# Altium schematic sheet ATMEGA328P ETH TCP.SchDoc
size A4; SheetNumber: 1; SheetTotal: 5
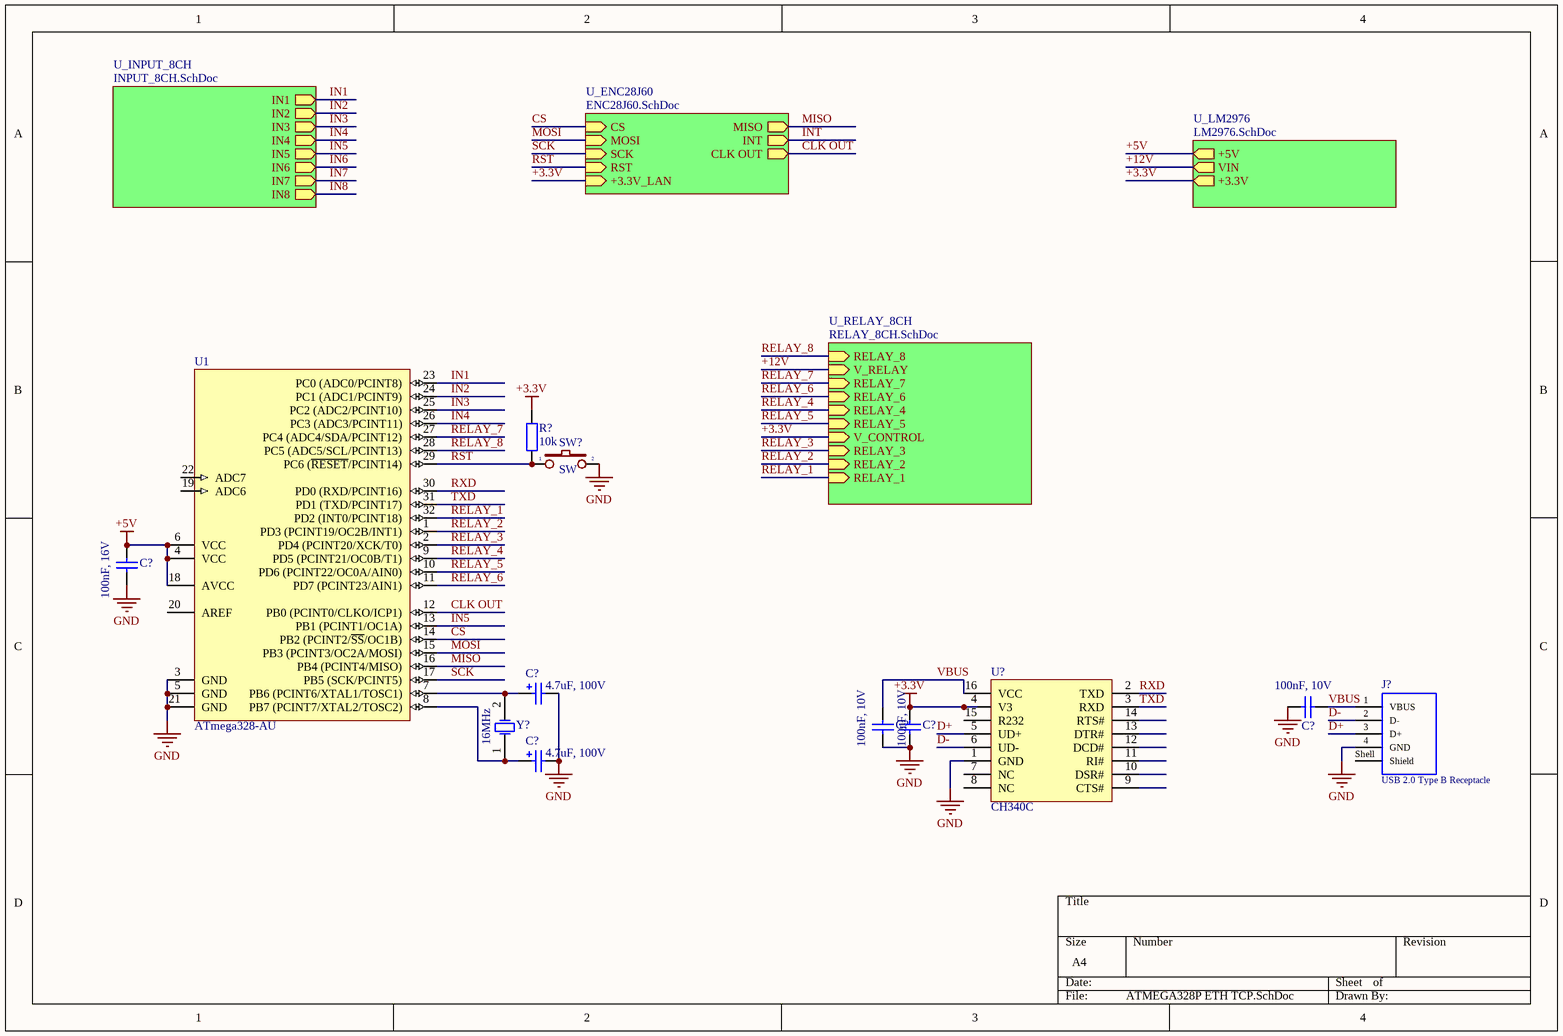
[diagram p0: ATMEGA328P ETH TCP.SchDoc]

## Parts
(Parts that share a designator on the sheet are numbered #1, #2 ... from top to bottom, then left to right.)
C?#1  100nF, 16V  [WCAP-CSGP_0402_L1W0.5H0.5]
C?#2  4.7uF, 100V  [WCAP-PSLP_D6.3H7.7]
C?#3  100nF, 10V  [WCAP-CSGP_0603_L1.6W0.8H0.8_Reflow]
C?#4  100nF, 10V  [WCAP-CSGP_0603_L1.6W0.8H0.8_Reflow]
C?#5  100nF, 10V  [WCAP-CSGP_0603_L1.6W0.8H0.8_Reflow]
C?#6  4.7uF, 100V  [WCAP-PSLP_D6.3H7.7]
J?  USB 2.0 Type B Receptacle  [61400416121]
R?  10k  [tro smd 0603]
SW?  SW  [SW1-SMD]
U1  ATmega328-AU  [TQFP32]
U?  CH340C  [SOIC16_50_284_25X90_SMT]
Y?  16MHz  [WE-XTAL_HC49/4HSMX]

## Sub-sheets
U_ENC28J60 = ENC28J60.SchDoc: CS (in), MOSI (in), MISO (out), SCK (in), INT (out), CLK OUT (out), RST (in), +3.3V_LAN (in)
U_INPUT_8CH = INPUT_8CH.SchDoc: IN1 (out), IN2 (out), IN3 (out), IN4 (out), IN5 (out), IN6 (out), IN7 (out), IN8 (out)
U_LM2976 = LM2976.SchDoc: +5V (out), VIN (out), +3.3V (out)
U_RELAY_8CH = RELAY_8CH.SchDoc: RELAY_1 (in), RELAY_2 (in), RELAY_3 (in), V_CONTROL (in), RELAY_5 (in), RELAY_4 (in), RELAY_6 (in), RELAY_7 (in), V_RELAY (in), RELAY_8 (in)

## Nets
+3.3V: C?#5.2 R?.2 U?.4(V3) ; sheet U_ENC28J60/+3.3V_LAN, sheet U_LM2976/+3.3V, sheet U_RELAY_8CH/V_CONTROL
+5V: C?#1.2 U1.4(VCC) U1.6(VCC) U1.18(AVCC) ; sheet U_LM2976/+5V
GND: C?#1.1 C?#2.2(N) C?#3.1 C?#4.1 C?#5.1 C?#6.2(N) J?.4(GND) SW?.2 U1.3(GND) U1.5(GND) U1.21(GND) U?.1(GND)
+12V: sheet U_LM2976/VIN, sheet U_RELAY_8CH/V_RELAY
CLK OUT: U1.12(PB0_(PCINT0/CLKO/ICP1)) ; sheet U_ENC28J60/CLK OUT
CS: U1.14(PB2_(PCINT2/~{SS}/OC1B)) ; sheet U_ENC28J60/CS
D+: J?.3(D+) U?.5(UD+)
D-: J?.2(D-) U?.6(UD-)
IN1: U1.23(PC0_(ADC0/PCINT8)) ; sheet U_INPUT_8CH/IN1
IN2: U1.24(PC1_(ADC1/PCINT9)) ; sheet U_INPUT_8CH/IN2
IN3: U1.25(PC2_(ADC2/PCINT10)) ; sheet U_INPUT_8CH/IN3
IN4: U1.26(PC3_(ADC3/PCINT11)) ; sheet U_INPUT_8CH/IN4
IN5: U1.13(PB1_(PCINT1/OC1A)) ; sheet U_INPUT_8CH/IN5
IN6: sheet U_INPUT_8CH/IN6
IN7: sheet U_INPUT_8CH/IN7
IN8: sheet U_INPUT_8CH/IN8
INT: sheet U_ENC28J60/INT
MISO: U1.16(PB4_(PCINT4/MISO)) ; sheet U_ENC28J60/MISO
MOSI: U1.15(PB3_(PCINT3/OC2A/MOSI)) ; sheet U_ENC28J60/MOSI
RELAY_1: U1.32(PD2_(INT0/PCINT18)) ; sheet U_RELAY_8CH/RELAY_1
RELAY_2: U1.1(PD3_(PCINT19/OC2B/INT1)) ; sheet U_RELAY_8CH/RELAY_2
RELAY_3: U1.2(PD4_(PCINT20/XCK/T0)) ; sheet U_RELAY_8CH/RELAY_3
RELAY_4: U1.9(PD5_(PCINT21/OC0B/T1)) ; sheet U_RELAY_8CH/RELAY_4
RELAY_5: U1.10(PD6_(PCINT22/OC0A/AIN0)) ; sheet U_RELAY_8CH/RELAY_5
RELAY_6: U1.11(PD7_(PCINT23/AIN1)) ; sheet U_RELAY_8CH/RELAY_6
RELAY_7: U1.27(PC4_(ADC4/SDA/PCINT12)) ; sheet U_RELAY_8CH/RELAY_7
RELAY_8: U1.28(PC5_(ADC5/SCL/PCINT13)) ; sheet U_RELAY_8CH/RELAY_8
RST: R?.1 SW?.1 U1.29(PC6_(~{RESET}/PCINT14)) ; sheet U_ENC28J60/RST
RXD: U1.30(PD0_(RXD/PCINT16)) U?.2(TXD)
SCK: U1.17(PB5_(SCK/PCINT5)) ; sheet U_ENC28J60/SCK
TXD: U1.31(PD1_(TXD/PCINT17)) U?.3(RXD)
VBUS: C?#3.2 C?#4.2 J?.1(VBUS) U?.16(VCC)
NetC?#2_1: C?#2.1(P) U1.7(PB6_(PCINT6/XTAL1/TOSC1)) Y?.2(OSC2)
NetC?#6_1: C?#6.1(P) U1.8(PB7_(PCINT7/XTAL2/TOSC2)) Y?.1(OSC1)

Not connected (* = marked no-connect by the designer): J? Shell(Shield); U1 19(ADC6) 20(AREF) 22(ADC7); U? 7(NC) 8(NC) 9(CTS#) 10(DSR#) 11(RI#) 12(DCD#) 13(DTR#) 14(RTS#) 15(R232)

## Library data of the parts
C?#1 = 885012105016: WCAP-CSGP Multilayer Ceramic Chip Capacitor, General Purpose, size 0402, X5R, 100nF, 16V; Manufacturer: Wurth Elektronik; Capacitance Tolerance: +/-20%; Dissipation Factor: 5%; Isolation Resistance: 5GOhm; Technical Reference: X5R0402104M016DFCT10000; Capacitance: 100nF; Ceramic Type: X5R; ComponentLink1Description: Manufacturer Link; ComponentLink1URL: http://www.we-online.de; ComponentLink2Description: Datasheet; ComponentLink2URL: https://www.we-online.com/catalog/datasheet/885012105016.pdf; Height: 0.5mm; Length: 1mm; Manufacturer Part Number: 885012105016; Mounting Technology: SMT; Operating Temperature max.: 85C; Operating Temperature min.: -55C; Packaging: Tape and Reel; Rated Voltage: 16V; Size: 0402; Width: 0.5mm
C?#2 C?#6 = 875105945001: WCAP-PSLP Aluminum Polymer Capacitor, V-Chip, SMT, D6.3xH7.7mm, 4.7uF, 100V; Manufacturer: Wurth Elektronik; Ripple Current: 1060mA; Technical Reference: PSED0774R7M100DVCTCB000; Capacitance Tolerance: +/-20%; Dissipation Factor: 12%; Rated Voltage: 100VDC; Leakage Current: 600uA; ESR: 100mOhm; Endurance: 2000h; ComponentLink1URL: http://www.we-online.de; ComponentLink1Description: Manufacturer; Capacitance: 4.7uF; Diameter: 6.3mm; Published Date: October 2020; Packaging: Tape and Reel; Operating Temperature: -55 to +105degC; Mounting Technology: SMT; Manufacturer Part Number: 875105945001; Height: 7.7mm; ComponentLink2URL: https://www.we-online.com/catalog/datasheet/875105945001.pdf; ComponentLink2Description: Datasheet
C?#3-C?#5 = 885012206020: WCAP-CSGP Multilayer Ceramic Chip Capacitor, General Purpose, size 0603, X7R, 100nF, 10V; Manufacturer: Wurth Elektronik; Capacitance Tolerance: +/-10%; Dissipation Factor: 5%; Isolation Resistance: 5GOhm; Technical Reference: X7R0603104K010DFCT10000; Capacitance: 100nF; Ceramic Type: X7R; ComponentLink1Description: Manufacturer Link; ComponentLink1URL: http://www.we-online.de; ComponentLink2Description: Datasheet; ComponentLink2URL: https://www.we-online.com/catalog/datasheet/885012206020.pdf; Height: 0.8mm; Length: 1.6mm; Manufacturer Part Number: 885012206020; Mounting Technology: SMT; Operating Temperature max.: 125C; Operating Temperature min.: -55C; Packaging: Tape and Reel; Rated Voltage: 10V; Size: 0603; Width: 0.8mm
J? = 61400416121: USB 2.0 Type B, Receptacle, Horizontal, THT; Manufacturer: Wurth Elektronik; Rated Current: 1.5A; Pin Number: 4; Interface Type: Type B; Working Voltage: 30VAC; ComponentLink1Description: Manufacturer; ComponentLink1URL: http://www.we-online.de; ComponentLink2Description: Datasheet; ComponentLink2URL: https://katalog.we-online.com/em/datasheet/61400416121.pdf; Published Date: August 2020; Manufacturer Part Number: 61400416121; Gender: Receptacle; Type: Horizontal; Packaging: Tray; Operating Temperature: -40 to +105degC; Mounting Technology: THT; Application: USB 2.0
R? = Tro 0603 5% 10k: Dán; Don_Vi: Con; So_Chan: 2; Ten_Linh_Kien: Trở 0603 5% 10k; Ma_Hang: MH006316; Chung_Loai: Dán; Kieu_Chan: *
SW? = SW2: Switch button 2 pin; Value: SW chip 2 pin
U1 = ATmega328-AU: 8-bit AVR Microcontroller, 32KB Flash, 1KB EEPROM, 2KB SRAM, 32-pin TQFP, Industrial Grade (-40°C to 85°C); Published: 1-Apr-2010; DatasheetVersion: revA, Jan-2010; PackageVersion: revB, Oct-2001; PackageReference: 32A; Publisher: Altium Limited; PackageDescription: 32-Lead, 7x7x1.0 mm Body, 0.8mm Lead Pitch, Thin Profile Plastic Quad Flat Package (TQFP); Supplier 1: Digi-Key; Supplier Part Number 1: ATMEGA328-AU-ND; Supplier 2: Mouser; Supplier Part Number 2: 556-ATMEGA328-AU; Code_JEDEC: MS-026-ABA; ComponentLink1Description: Manufacturer Link; ComponentLink1URL: http://www.atmel.com/products/avr/default.asp?; ComponentLink2Description: ATmega48A/48PA/88A/88PA/168A/168PA/328/328P Datasheet; ComponentLink2URL: http://www.atmel.com/dyn/resources/prod_documents/8271.pdf; ComponentLink3Description: ATmega48A/48PA/88A/88PA/168A/168PA/328/328P Summary; ComponentLink3URL: http://www.atmel.com/dyn/resources/prod_documents/8271S.pdf; ComponentLink4Description: Atmel.com Home; ComponentLink4URL: http://www.atmel.com
U? = CH340C: USB Bridge, USB to UART USB 2.0 UART Interface; Manufacturer: Olimex; Alternate Part Number-1: NA; Manufacturer Part Number: CH340C; Case/Package: SOIC16; Supplier-1: LCSC; Supplier Part Number-1: C84681
Y? = 830003237: WE-XTAL Quartz Crystal, SMT, HC49/4HSMX, 16MHz, +/-30ppm; Manufacturer: Wurth Elektronik; Frequency Stability: +/-50ppm; Load Capacitance: 16pF; ComponentLink1Description: Manufacturer; ComponentLink1URL: http://www.we-online.de; ComponentLink2Description: Datasheet; ComponentLink2URL: https://katalog.we-online.com/pbs/datasheet/830003237.pdf; Operating Temperature: -10 to +60degC; Packaging: Tape and Reel; Manufacturer Part Number: 830003237; Published Date: July 2020; Size: HC49/4HSMX; Frequency: 16MHz; Frequency Tolerance: +/-30ppm; Mounting Technology: SMT